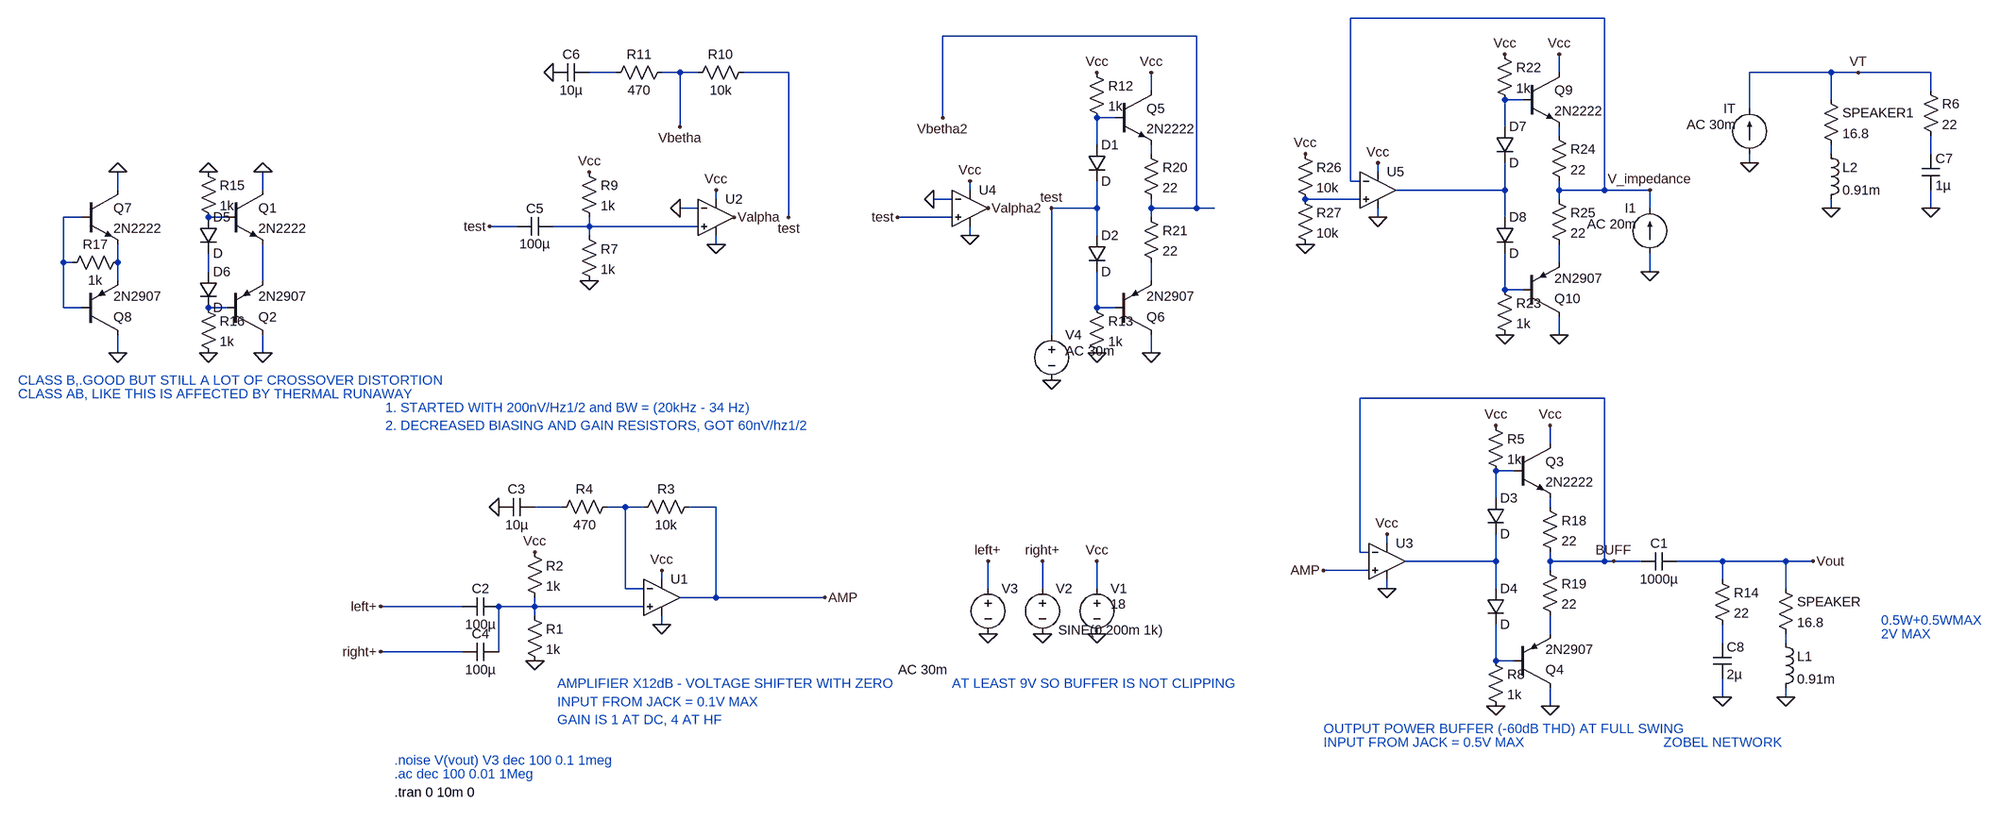
[diagram p0: schematic amp_cell.asc]
amp_cell.asc, the LTspice schematic file:
Version 4
SHEET 1 1156 772
WIRE 160 -960 -288 -960
WIRE -560 -928 -1008 -928
WIRE -1584 -864 -1632 -864
WIRE -1472 -864 -1504 -864
WIRE -1440 -864 -1472 -864
WIRE -1280 -864 -1360 -864
WIRE 80 -864 80 -896
WIRE 560 -864 416 -864
WIRE 608 -864 560 -864
WIRE 736 -864 608 -864
WIRE -640 -832 -640 -864
WIRE 736 -832 736 -864
WIRE 16 -816 -16 -816
WIRE 560 -816 560 -864
WIRE 416 -800 416 -864
WIRE -1008 -784 -1008 -928
WIRE -704 -784 -736 -784
WIRE -1472 -768 -1472 -864
WIRE -16 -768 -16 -816
WIRE 80 -752 80 -768
WIRE -736 -736 -736 -784
WIRE -640 -720 -640 -736
WIRE 560 -720 560 -736
WIRE 736 -720 736 -752
WIRE 416 -704 416 -720
WIRE -240 -688 -240 -704
WIRE -288 -672 -288 -960
WIRE -272 -672 -288 -672
WIRE -2464 -656 -2464 -688
WIRE -2208 -656 -2208 -688
WIRE -960 -656 -960 -672
WIRE -16 -656 -16 -704
WIRE -16 -656 -208 -656
WIRE 80 -656 80 -672
WIRE 160 -656 160 -960
WIRE 160 -656 80 -656
WIRE 240 -656 160 -656
WIRE -1408 -640 -1408 -656
WIRE -992 -640 -1024 -640
WIRE -272 -640 -368 -640
WIRE 80 -640 80 -656
WIRE -1440 -624 -1472 -624
WIRE -736 -624 -736 -672
WIRE -736 -624 -816 -624
WIRE -640 -624 -640 -640
WIRE -560 -624 -560 -928
WIRE -560 -624 -640 -624
WIRE -528 -624 -560 -624
WIRE 240 -624 240 -656
WIRE 560 -624 560 -640
WIRE 736 -624 736 -656
WIRE -2528 -608 -2560 -608
WIRE -2272 -608 -2304 -608
WIRE -1280 -608 -1280 -864
WIRE -992 -608 -1088 -608
WIRE -640 -608 -640 -624
WIRE -240 -608 -240 -624
WIRE -16 -608 -16 -656
WIRE -1760 -592 -1808 -592
WIRE -1632 -592 -1632 -608
WIRE -1632 -592 -1696 -592
WIRE -1440 -592 -1632 -592
WIRE -1632 -576 -1632 -592
WIRE -960 -576 -960 -592
WIRE -736 -576 -736 -624
WIRE -1408 -560 -1408 -576
WIRE -2560 -528 -2560 -608
WIRE -2544 -528 -2560 -528
WIRE -2464 -528 -2464 -560
WIRE 80 -528 80 -560
WIRE -2304 -512 -2304 -544
WIRE 240 -512 240 -544
WIRE -2464 -496 -2464 -528
WIRE -2208 -496 -2208 -560
WIRE -640 -496 -640 -528
WIRE -16 -480 -16 -544
WIRE 16 -480 -16 -480
WIRE -2560 -448 -2560 -528
WIRE -2528 -448 -2560 -448
WIRE -2272 -448 -2304 -448
WIRE -736 -448 -736 -512
WIRE -704 -448 -736 -448
WIRE -816 -400 -816 -624
WIRE 80 -400 80 -432
WIRE -2464 -368 -2464 -400
WIRE -2208 -368 -2208 -400
WIRE -640 -368 -640 -400
WIRE 160 -288 -272 -288
WIRE 64 -208 64 -240
WIRE 0 -160 -32 -160
WIRE -32 -112 -32 -160
WIRE -1680 -96 -1728 -96
WIRE -1568 -96 -1600 -96
WIRE -1536 -96 -1568 -96
WIRE -1408 -96 -1456 -96
WIRE 64 -96 64 -112
WIRE -224 -32 -224 -48
WIRE -272 -16 -272 -288
WIRE -256 -16 -272 -16
WIRE -32 0 -32 -48
WIRE -32 0 -192 0
WIRE 64 0 64 -16
WIRE 160 0 160 -288
WIRE 160 0 64 0
WIRE 176 0 160 0
WIRE 224 0 176 0
WIRE 368 0 288 0
WIRE 480 0 368 0
WIRE 528 0 480 0
WIRE -256 16 -336 16
WIRE 64 16 64 0
WIRE -1504 32 -1504 16
WIRE 368 32 368 0
WIRE -1568 48 -1568 -96
WIRE -1536 48 -1568 48
WIRE -928 48 -928 0
WIRE -832 48 -832 0
WIRE -736 48 -736 0
WIRE -224 48 -224 32
WIRE -32 48 -32 0
WIRE 480 48 480 0
WIRE -1408 64 -1408 -96
WIRE -1408 64 -1472 64
WIRE -1216 64 -1408 64
WIRE -1856 80 -2000 80
WIRE -1728 80 -1728 64
WIRE -1728 80 -1792 80
WIRE -1536 80 -1728 80
WIRE -1728 96 -1728 80
WIRE -1504 112 -1504 96
WIRE 64 128 64 96
WIRE 368 144 368 112
WIRE 480 144 480 128
WIRE -1856 160 -2000 160
WIRE -1792 160 -1792 80
WIRE -32 176 -32 112
WIRE 0 176 -32 176
WIRE 368 240 368 208
WIRE 480 240 480 224
WIRE 64 256 64 224
FLAG -736 0 Vcc
FLAG -832 128 0
FLAG -832 0 right+
FLAG -336 16 AMP
FLAG -224 48 0
FLAG -224 -48 Vcc
FLAG 528 0 Vout
FLAG -736 128 0
FLAG -1504 112 0
FLAG -1504 16 Vcc
FLAG -1728 176 0
FLAG -1728 -16 Vcc
FLAG -1792 -96 0
FLAG 176 0 BUFF
FLAG -928 128 0
FLAG -928 0 left+
FLAG -2000 80 left+
FLAG 64 -240 Vcc
FLAG 64 256 0
FLAG -32 256 0
FLAG -32 -240 Vcc
FLAG -1408 -560 0
FLAG -1408 -656 Vcc
FLAG -1632 -496 0
FLAG -1632 -688 Vcc
FLAG -1696 -864 0
FLAG -1472 -768 Vbetha
FLAG -816 -320 0
FLAG -816 -624 test
FLAG -1376 -608 Valpha
FLAG -1808 -592 test
FLAG -1472 -624 0
FLAG -2000 160 right+
FLAG -1216 64 AMP
FLAG -1280 -608 test
FLAG -960 -576 0
FLAG -960 -672 Vcc
FLAG -928 -624 Valpha2
FLAG -1024 -640 0
FLAG -1088 -608 test
FLAG -1008 -784 Vbetha2
FLAG 480 240 0
FLAG 608 -864 VT
FLAG 560 -624 0
FLAG 416 -704 0
FLAG 736 -624 0
FLAG 368 240 0
FLAG -2208 -368 0
FLAG -2304 -368 0
FLAG -2464 -368 0
FLAG -2464 -688 0
FLAG -2304 -688 0
FLAG -2208 -688 0
FLAG -640 -864 Vcc
FLAG -640 -368 0
FLAG -736 -368 0
FLAG -736 -864 Vcc
FLAG -240 -608 0
FLAG -240 -704 Vcc
FLAG 80 -896 Vcc
FLAG 80 -400 0
FLAG -16 -400 0
FLAG -16 -896 Vcc
FLAG 240 -512 0
FLAG 240 -656 V_impedance
FLAG -368 -560 0
FLAG -368 -720 Vcc
SYMBOL voltage -736 32 R0
WINDOW 123 0 0 Left 0
WINDOW 39 0 0 Left 0
WINDOW 3 24 44 Left 2
SYMATTR Value 18
SYMATTR InstName V1
SYMBOL voltage -832 32 R0
WINDOW 123 24 180 Left 2
WINDOW 39 0 0 Left 0
WINDOW 3 28 90 Left 2
SYMATTR Value SINE(0 200m 1k)
SYMATTR InstName V2
SYMBOL cap 288 -16 R90
WINDOW 0 0 32 VBottom 2
WINDOW 3 32 32 VTop 2
SYMATTR InstName C1
SYMATTR Value 1000µ
SYMBOL res -1744 80 R0
SYMATTR InstName R1
SYMATTR Value 1k
SYMBOL res -1744 -32 R0
SYMATTR InstName R2
SYMATTR Value 1k
SYMBOL cap -1792 64 R90
WINDOW 0 0 32 VBottom 2
WINDOW 3 32 32 VTop 2
SYMATTR InstName C2
SYMATTR Value 100µ
SYMBOL res -1440 -112 R90
WINDOW 0 0 56 VBottom 2
WINDOW 3 32 56 VTop 2
SYMATTR InstName R3
SYMATTR Value 10k
SYMBOL res -1584 -112 R90
WINDOW 0 0 56 VBottom 2
WINDOW 3 32 56 VTop 2
SYMATTR InstName R4
SYMATTR Value 470
SYMBOL cap -1728 -112 R90
WINDOW 0 0 32 VBottom 2
WINDOW 3 32 32 VTop 2
SYMATTR InstName C3
SYMATTR Value 10µ
SYMBOL OpAmps\\UniversalOpAmp -1504 64 R0
SYMATTR InstName U1
SYMATTR Value2 Avol=200k GBW=1.5Meg Vos=0
SYMBOL voltage -928 32 R0
WINDOW 123 -159 160 Left 2
WINDOW 39 0 0 Left 0
WINDOW 3 -159 188 Left 2
SYMATTR Value2 AC 30m
SYMATTR Value ""
SYMATTR InstName V3
SYMBOL OpAmps\\UniversalOpamp2 -224 0 R0
SYMATTR InstName U3
SYMATTR Value2 Avol=200k GBW=1.5Meg Slew=10Meg
SYMATTR SpiceLine Ilimit=25m Rail=2 Vos=0
SYMBOL npn 0 -208 R0
SYMATTR InstName Q3
SYMATTR Value 2N2222
SYMBOL pnp 0 224 M180
SYMATTR InstName Q4
SYMATTR Value 2N2907
SYMBOL res -48 -256 R0
SYMATTR InstName R5
SYMATTR Value 1k
SYMBOL res -48 160 R0
SYMATTR InstName R8
SYMATTR Value 1k
SYMBOL diode -48 -112 R0
SYMATTR InstName D3
SYMBOL diode -48 48 R0
SYMATTR InstName D4
SYMBOL res -1648 -592 R0
SYMATTR InstName R7
SYMATTR Value 1k
SYMBOL res -1648 -704 R0
SYMATTR InstName R9
SYMATTR Value 1k
SYMBOL cap -1696 -608 R90
WINDOW 0 0 32 VBottom 2
WINDOW 3 32 32 VTop 2
SYMATTR InstName C5
SYMATTR Value 100µ
SYMBOL res -1344 -880 R90
WINDOW 0 0 56 VBottom 2
WINDOW 3 32 56 VTop 2
SYMATTR InstName R10
SYMATTR Value 10k
SYMBOL res -1488 -880 R90
WINDOW 0 0 56 VBottom 2
WINDOW 3 32 56 VTop 2
SYMATTR InstName R11
SYMATTR Value 470
SYMBOL cap -1632 -880 R90
WINDOW 0 0 32 VBottom 2
WINDOW 3 32 32 VTop 2
SYMATTR InstName C6
SYMATTR Value 10µ
SYMBOL OpAmps\\UniversalOpAmp -1408 -608 R0
SYMATTR InstName U2
SYMATTR Value2 Avol=200k GBW=1.5Meg Vos=0
SYMBOL voltage -816 -416 R0
WINDOW 123 24 44 Left 2
WINDOW 39 0 0 Left 0
SYMATTR Value2 AC 30m
SYMATTR InstName V4
SYMATTR Value ""
SYMBOL cap -1792 144 R90
WINDOW 0 0 32 VBottom 2
WINDOW 3 32 32 VTop 2
SYMATTR InstName C4
SYMATTR Value 100µ
SYMBOL OpAmps\\UniversalOpAmp -960 -624 R0
SYMATTR InstName U4
SYMATTR Value2 Avol=200k GBW=1.5Meg Vos=0
SYMBOL res 464 32 R0
SYMATTR InstName SPEAKER
SYMATTR Value 16.8
SYMBOL ind 464 128 R0
SYMATTR InstName L1
SYMATTR Value 0.91m
SYMBOL res 544 -832 R0
SYMATTR InstName SPEAKER1
SYMATTR Value 16.8
SYMBOL ind 544 -736 R0
SYMATTR InstName L2
SYMATTR Value 0.91m
SYMBOL current 416 -720 R180
WINDOW 0 24 80 Left 2
WINDOW 3 24 0 Left 2
WINDOW 123 24 52 Left 2
WINDOW 39 0 0 Left 0
SYMATTR InstName IT
SYMATTR Value ""
SYMATTR Value2 AC 30m
SYMBOL res 720 -848 R0
SYMATTR InstName R6
SYMATTR Value 22
SYMBOL cap 720 -720 R0
SYMATTR InstName C7
SYMATTR Value 1µ
SYMBOL res 352 16 R0
SYMATTR InstName R14
SYMATTR Value 22
SYMBOL cap 352 144 R0
SYMATTR InstName C8
SYMATTR Value 2µ
SYMBOL npn -2272 -656 R0
SYMATTR InstName Q1
SYMATTR Value 2N2222
SYMBOL pnp -2272 -400 M180
SYMATTR InstName Q2
SYMATTR Value 2N2907
SYMBOL res -2320 -704 R0
SYMATTR InstName R15
SYMATTR Value 1k
SYMBOL res -2320 -464 R0
SYMATTR InstName R16
SYMATTR Value 1k
SYMBOL diode -2320 -608 R0
SYMATTR InstName D5
SYMBOL diode -2320 -512 R0
SYMATTR InstName D6
SYMBOL npn -2528 -656 R0
SYMATTR InstName Q7
SYMATTR Value 2N2222
SYMBOL pnp -2528 -400 M180
SYMATTR InstName Q8
SYMATTR Value 2N2907
SYMBOL res -2448 -544 R90
WINDOW 0 0 56 VBottom 2
WINDOW 3 32 56 VTop 2
SYMATTR InstName R17
SYMATTR Value 1k
SYMBOL res 48 -112 R0
SYMATTR InstName R18
SYMATTR Value 22
SYMBOL res 48 0 R0
SYMATTR InstName R19
SYMATTR Value 22
SYMBOL npn -704 -832 R0
SYMATTR InstName Q5
SYMATTR Value 2N2222
SYMBOL pnp -704 -400 M180
SYMATTR InstName Q6
SYMATTR Value 2N2907
SYMBOL res -752 -880 R0
SYMATTR InstName R12
SYMATTR Value 1k
SYMBOL res -752 -464 R0
SYMATTR InstName R13
SYMATTR Value 1k
SYMBOL diode -752 -736 R0
SYMATTR InstName D1
SYMBOL diode -752 -576 R0
SYMATTR InstName D2
SYMBOL res -656 -736 R0
SYMATTR InstName R20
SYMATTR Value 22
SYMBOL res -656 -624 R0
SYMATTR InstName R21
SYMATTR Value 22
SYMBOL OpAmps\\UniversalOpAmp -240 -656 R0
SYMATTR InstName U5
SYMATTR Value2 Avol=200k GBW=1.5Meg Vos=0
SYMBOL npn 16 -864 R0
SYMATTR InstName Q9
SYMATTR Value 2N2222
SYMBOL pnp 16 -432 M180
SYMATTR InstName Q10
SYMATTR Value 2N2907
SYMBOL res -32 -912 R0
SYMATTR InstName R22
SYMATTR Value 1k
SYMBOL res -32 -496 R0
SYMATTR InstName R23
SYMATTR Value 1k
SYMBOL diode -32 -768 R0
SYMATTR InstName D7
SYMBOL diode -32 -608 R0
SYMATTR InstName D8
SYMBOL res 64 -768 R0
SYMATTR InstName R24
SYMATTR Value 22
SYMBOL res 64 -656 R0
SYMATTR InstName R25
SYMATTR Value 22
SYMBOL current 240 -544 R180
WINDOW 0 24 80 Left 2
WINDOW 3 24 0 Left 2
WINDOW 123 24 52 Left 2
WINDOW 39 0 0 Left 0
SYMATTR InstName I1
SYMATTR Value ""
SYMATTR Value2 AC 20m
SYMBOL res -384 -736 R0
SYMATTR InstName R26
SYMATTR Value 10k
SYMBOL res -384 -656 R0
SYMATTR InstName R27
SYMATTR Value 10k
TEXT -1976 376 Left 2 ;.ac dec 100 0.01 1Meg
TEXT -336 296 Left 2 ;OUTPUT POWER BUFFER (-60dB THD) AT FULL SWING
TEXT 648 104 Left 2 ;0.5W+0.5WMAX
TEXT 648 128 Left 2 ;2V MAX
TEXT -336 320 Left 2 ;INPUT FROM JACK = 0.5V MAX
TEXT -1688 216 Left 2 ;AMPLIFIER X12dB - VOLTAGE SHIFTER WITH ZERO
TEXT -1688 248 Left 2 ;INPUT FROM JACK = 0.1V MAX
TEXT -1688 280 Left 2 ;GAIN IS 1 AT DC, 4 AT HF
TEXT -992 216 Left 2 ;AT LEAST 9V SO BUFFER IS NOT CLIPPING
TEXT -1976 352 Left 2 ;.noise V(vout) V3 dec 100 0.1 1meg
TEXT -1992 -272 Left 2 ;1. STARTED WITH 200nV/Hz1/2 and BW = (20kHz - 34 Hz)
TEXT -1992 -240 Left 2 ;2. DECREASED BIASING AND GAIN RESISTORS, GOT 60nV/hz1/2
TEXT -1976 408 Left 2 !.tran 0 10m 0
TEXT 264 320 Left 2 ;ZOBEL NETWORK
TEXT -2640 -320 Left 2 ;CLASS B,.GOOD BUT STILL A LOT OF CROSSOVER DISTORTION
TEXT -2640 -296 Left 2 ;CLASS AB, LIKE THIS IS AFFECTED BY THERMAL RUNAWAY

The netlist it stands for:
* amp_cell.asc
V1 Vcc 0 18
V2 right+ 0 SINE(0 200m 1k)
C1 Vout BUFF 1000µ
R1 N026 0 1k
R2 Vcc N026 1k
C2 N026 left+ 100µ
R3 AMP N023 10k
R4 N023 N022 470
C3 N022 0 10µ
XU1 N026 N023 Vcc 0 AMP level1 Avol=200k GBW=1.5Meg Vos=0 En=0 Enk=0 In=0 Ink=0 Rin=500Meg  ; pins In+ In- V+ V- OUT
V3 left+ 0 AC 30m
XU3 AMP BUFF Vcc 0 N025 level.2 Avol=200k GBW=1.5Meg Slew=10Meg Ilimit=25m Rail=2 Vos=0 en=0 enk=0 in=0 ink=0 Rin=500Meg  ; pins IN+ IN- V+ V- OUT
Q3 Vcc N021 N024 0 2N2222
Q4 0 N030 N027 0 2N2907
R5 Vcc N021 1k
R8 N030 0 1k
D3 N021 N025 D
D4 N025 N030 D
R7 N012 0 1k
R9 Vcc N012 1k
C5 N012 test 100µ
R10 test Vbetha 10k
R11 Vbetha N001 470
C6 N001 0 10µ
XU2 N012 0 Vcc 0 Valpha level1 Avol=200k GBW=1.5Meg Vos=0 En=0 Enk=0 In=0 Ink=0 Rin=500Meg  ; pins In+ In- V+ V- OUT
V4 test 0 AC 30m
C4 N026 right+ 100µ
XU4 test 0 Vcc 0 Valpha2 level1 Avol=200k GBW=1.5Meg Vos=0 En=0 Enk=0 In=0 Ink=0 Rin=500Meg  ; pins In+ In- V+ V- OUT
R§SPEAKER Vout N029 16.8
L1 N029 0 0.91m
R§SPEAKER1 VT N006 16.8
L2 N006 0 0.91m
IT 0 VT AC 30m
R6 VT N007 22
C7 N007 0 1µ
R14 Vout N028 22
C8 N028 0 2µ
Q1 0 N011 N016 0 2N2222
Q2 0 N019 N016 0 2N2907
R15 0 N011 1k
R16 N019 0 1k
D5 N011 N015 D
D6 N015 N019 D
Q7 0 N010 N013 0 2N2222
Q8 0 N010 N013 0 2N2907
R17 N013 N010 1k
R18 N024 BUFF 22
R19 BUFF N027 22
Q5 Vcc N003 N005 0 2N2222
Q6 0 N020 N017 0 2N2907
R12 Vcc N003 1k
R13 N020 0 1k
D1 N003 test D
D2 test N020 D
R20 N005 Vbetha2 22
R21 Vbetha2 N017 22
XU5 N009 V_impedance Vcc 0 N008 level1 Avol=200k GBW=1.5Meg Vos=0 En=0 Enk=0 In=0 Ink=0 Rin=500Meg  ; pins In+ In- V+ V- OUT
Q9 Vcc N002 N004 0 2N2222
Q10 0 N018 N014 0 2N2907
R22 Vcc N002 1k
R23 N018 0 1k
D7 N002 N008 D
D8 N008 N018 D
R24 N004 V_impedance 22
R25 V_impedance N014 22
I1 0 V_impedance AC 20m
R26 Vcc N009 10k
R27 N009 0 10k
.model D D
.lib standard.dio
.model NPN NPN
.model PNP PNP
.lib standard.bjt
* .ac dec 100 0.01 1Meg
* OUTPUT POWER BUFFER (-60dB THD) AT FULL SWING
* 0.5W+0.5WMAX
* 2V MAX
* INPUT FROM JACK = 0.5V MAX
* AMPLIFIER X12dB - VOLTAGE SHIFTER WITH ZERO
* INPUT FROM JACK = 0.1V MAX
* GAIN IS 1 AT DC, 4 AT HF
* AT LEAST 9V SO BUFFER IS NOT CLIPPING
* .noise V(vout) V3 dec 100 0.1 1meg
* 1. STARTED WITH 200nV/Hz1/2 and BW = (20kHz - 34 Hz)
* 2. DECREASED BIASING AND GAIN RESISTORS, GOT 60nV/hz1/2
.tran 0 10m 0
* ZOBEL NETWORK
* CLASS B,.GOOD BUT STILL A LOT OF CROSSOVER DISTORTION
* CLASS AB, LIKE THIS IS AFFECTED BY THERMAL RUNAWAY
.lib UniversalOpAmp1.lib
.lib UniversalOpamps2.sub
.backanno
.end